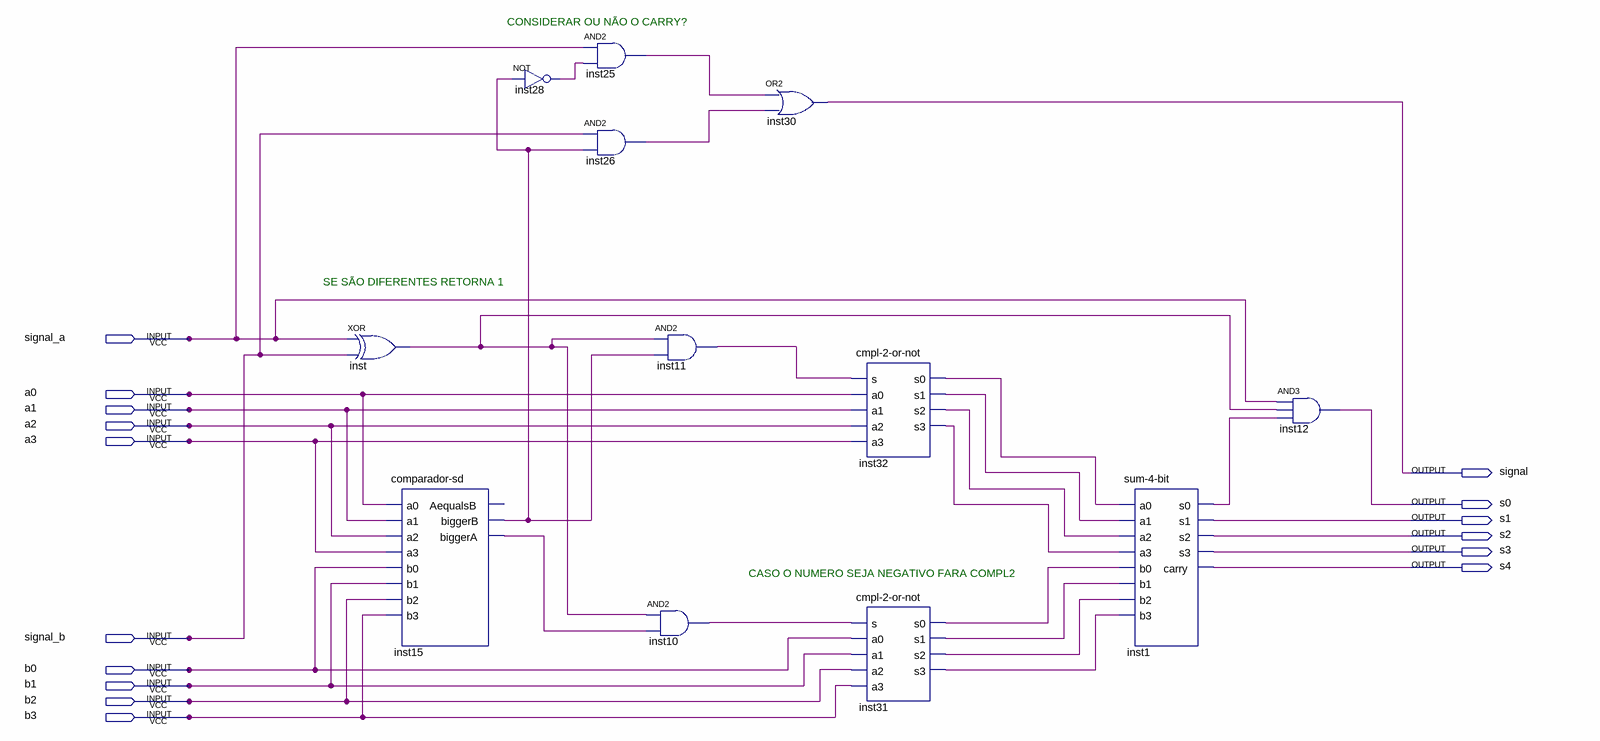
[diagram p0: schematic sheet]
// Quartus schematic subtrator-sd.bdf as structural Verilog: 12 symbols, 16 pins
module \subtrator-sd  (
  input  signal_a,
  input  a0,
  input  a1,
  input  a2,
  input  a3,
  input  signal_b,
  input  b0,
  input  b1,
  input  b2,
  input  b3,
  output signal,
  output s0,
  output s1,
  output s2,
  output s3,
  output s4
);

  wire inst1_s0, inst10_out, inst11_out, inst15_biggera, inst15_biggerb, inst25_out, inst26_out, inst28_out,
       inst31_s0, inst31_s1, inst31_s2, inst31_s3, inst32_s0, inst32_s1, inst32_s2, inst32_s3, inst_out;

  xor inst (inst_out, signal_a, signal_b);
  \comparador-sd  inst15 (
    .a0(a0), .a1(a1), .a2(a2), .a3(a3), .b0(b0), .b1(b1), .b2(b2), .b3(b3), .biggerB(inst15_biggerb),
    .biggerA(inst15_biggera));  // open: AequalsB
  not inst28 (inst28_out, inst15_biggerb);
  and inst25 (inst25_out, signal_a, inst28_out);
  and inst26 (inst26_out, signal_b, inst15_biggerb);
  and inst10 (inst10_out, inst_out, inst15_biggera);
  and inst11 (inst11_out, inst_out, inst15_biggerb);
  or inst30 (signal, inst25_out, inst26_out);
  \cmpl-2-or-not  inst32 (
    .s(inst11_out), .a0(a0), .a1(a1), .a2(a2), .a3(a3), .s0(inst32_s0), .s1(inst32_s1), .s2(inst32_s2),
    .s3(inst32_s3));
  \cmpl-2-or-not  inst31 (
    .s(inst10_out), .a0(b0), .a1(b1), .a2(b2), .a3(b3), .s0(inst31_s0), .s1(inst31_s1), .s2(inst31_s2),
    .s3(inst31_s3));
  \sum-4-bit  inst1 (
    .a0(inst32_s0), .a1(inst32_s1), .a2(inst32_s2), .a3(inst32_s3), .b0(inst31_s0), .b1(inst31_s1),
    .b2(inst31_s2), .b3(inst31_s3), .s0(inst1_s0), .s1(s1), .s2(s2), .s3(s3), .carry(s4));
  and inst12 (s0, signal_a, inst_out, inst1_s0);

  // Notes on the sheet:
  //    CONSIDERAR OU NÃO O CARRY?
  //   SE SÃO DIFERENTES RETORNA 1
  //   CASO O NUMERO SEJA NEGATIVO FARA COMPL2
endmodule
